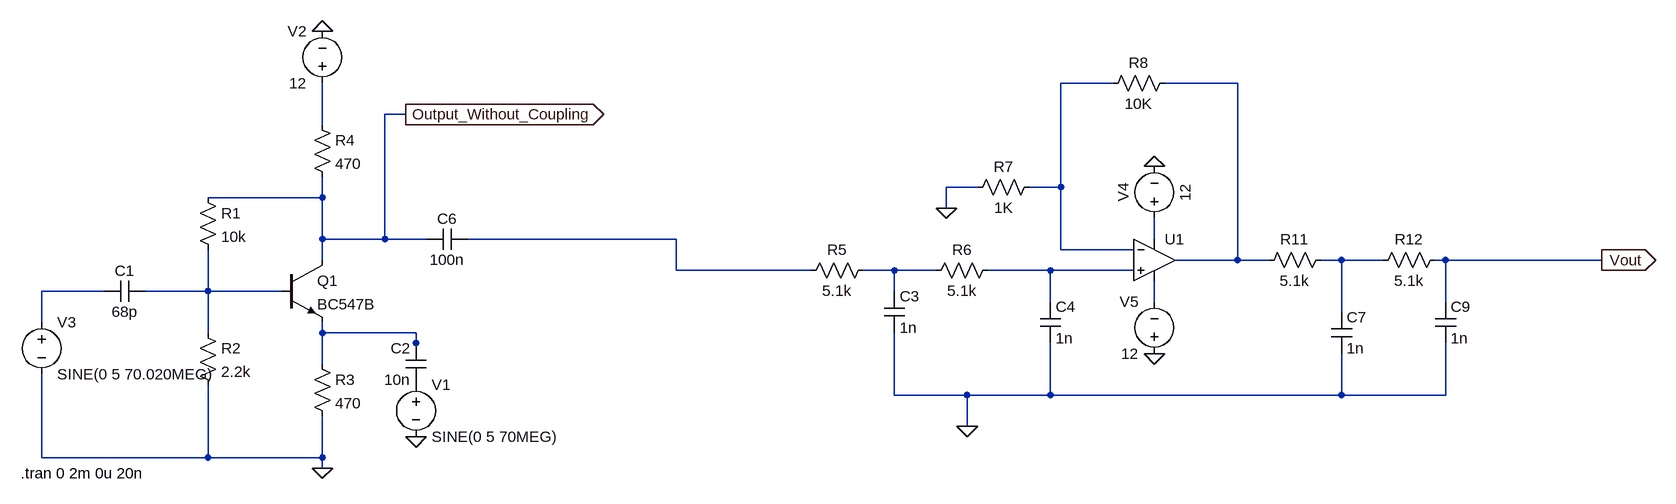
[diagram p0: schematic Mixer_Circuit_Cascade_LowPass.asc]
Mixer_Circuit_Cascade_LowPass.asc, the LTspice schematic file:
Version 4.1
SHEET 1 2324 680
WIRE 1424 -160 1344 -160
WIRE 1616 -160 1504 -160
WIRE 336 -112 304 -112
WIRE 208 -96 208 -160
WIRE 1216 0 1168 0
WIRE 1344 0 1344 -160
WIRE 1344 0 1296 0
WIRE 208 16 208 -16
WIRE 208 16 32 16
WIRE 1168 32 1168 0
WIRE 208 80 208 16
WIRE 304 80 304 -112
WIRE 304 80 208 80
WIRE 368 80 304 80
WIRE 752 80 432 80
WIRE 1488 80 1488 48
WIRE 1344 96 1344 0
WIRE 1456 96 1344 96
WIRE 208 112 208 80
WIRE 1616 112 1616 -160
WIRE 1616 112 1520 112
WIRE 1664 112 1616 112
WIRE 1776 112 1744 112
WIRE 1840 112 1776 112
WIRE 1936 112 1920 112
WIRE 2176 112 1936 112
WIRE 752 128 752 80
WIRE 960 128 752 128
WIRE 1088 128 1040 128
WIRE 1152 128 1088 128
WIRE 1328 128 1232 128
WIRE 1456 128 1328 128
WIRE -128 160 -224 160
WIRE 32 160 32 96
WIRE 32 160 -64 160
WIRE 144 160 32 160
WIRE 1088 160 1088 128
WIRE 1328 176 1328 128
WIRE 1488 176 1488 144
WIRE 1936 176 1936 112
WIRE 1776 192 1776 112
WIRE -224 208 -224 160
WIRE 32 224 32 160
WIRE 208 224 208 208
WIRE 352 224 208 224
WIRE 352 240 352 224
WIRE 352 256 352 240
WIRE 208 272 208 224
WIRE 1088 320 1088 224
WIRE 1200 320 1088 320
WIRE 1328 320 1328 240
WIRE 1328 320 1200 320
WIRE 1776 320 1776 256
WIRE 1776 320 1328 320
WIRE 1936 320 1936 240
WIRE 1936 320 1776 320
WIRE 1200 368 1200 320
WIRE -224 416 -224 288
WIRE 32 416 32 304
WIRE 32 416 -224 416
WIRE 208 416 208 352
WIRE 208 416 32 416
WIRE 208 432 208 416
FLAG 208 -240 0
FLAG 336 -112 Output_Without_Coupling
IOPIN 336 -112 Out
FLAG 208 432 0
FLAG 352 384 0
FLAG 2176 112 Vout
IOPIN 2176 112 Out
FLAG 1200 368 0
FLAG 1488 -32 0
FLAG 1488 256 0
FLAG 1168 32 0
SYMBOL npn 144 112 R0
SYMATTR InstName Q1
SYMATTR Value BC547B
SYMBOL res 16 0 R0
SYMATTR InstName R1
SYMATTR Value 10k
SYMBOL cap -64 144 R90
WINDOW 0 0 32 VBottom 2
WINDOW 3 32 32 VTop 2
SYMATTR InstName C1
SYMATTR Value 68p
SYMBOL cap 368 304 R180
WINDOW 0 24 56 Left 2
WINDOW 3 24 8 Left 2
SYMATTR InstName C2
SYMATTR Value 10n
SYMBOL res 192 256 R0
SYMATTR InstName R3
SYMATTR Value 470
SYMBOL res 192 -112 R0
SYMATTR InstName R4
SYMATTR Value 470
SYMBOL voltage 352 288 R0
WINDOW 123 0 0 Left 0
WINDOW 39 0 0 Left 0
SYMATTR InstName V1
SYMATTR Value SINE(0 5 70MEG)
SYMBOL voltage 208 -144 R180
WINDOW 0 24 96 Left 2
WINDOW 3 24 16 Left 2
WINDOW 123 0 0 Left 0
WINDOW 39 0 0 Left 0
SYMATTR InstName V2
SYMATTR Value 12
SYMBOL voltage -224 192 R0
WINDOW 123 0 0 Left 0
WINDOW 39 0 0 Left 0
SYMATTR InstName V3
SYMATTR Value SINE(0 5 70.020MEG)
SYMBOL res 16 208 R0
SYMATTR InstName R2
SYMATTR Value 2.2k
SYMBOL OpAmps\\UniversalOpAmp 1488 112 R0
SYMATTR InstName U1
SYMBOL res 1056 112 R90
WINDOW 0 0 56 VBottom 2
WINDOW 3 32 56 VTop 2
SYMATTR InstName R5
SYMATTR Value 5.1k
SYMBOL res 1248 112 R90
WINDOW 0 0 56 VBottom 2
WINDOW 3 32 56 VTop 2
SYMATTR InstName R6
SYMATTR Value 5.1k
SYMBOL cap 1072 160 R0
SYMATTR InstName C3
SYMATTR Value 1n
SYMBOL cap 1312 176 R0
SYMATTR InstName C4
SYMATTR Value 1n
SYMBOL res 1312 -16 R90
WINDOW 0 0 56 VBottom 2
WINDOW 3 32 56 VTop 2
SYMATTR InstName R7
SYMATTR Value 1K
SYMBOL res 1520 -176 R90
WINDOW 0 0 56 VBottom 2
WINDOW 3 32 56 VTop 2
SYMATTR InstName R8
SYMATTR Value 10K
SYMBOL cap 432 64 R90
WINDOW 0 0 32 VBottom 2
WINDOW 3 32 32 VTop 2
SYMATTR InstName C6
SYMATTR Value 100n
SYMBOL voltage 1488 64 R180
WINDOW 0 32 56 VTop 2
WINDOW 3 -32 56 VBottom 2
WINDOW 123 0 0 Left 0
WINDOW 39 0 0 Left 0
SYMATTR InstName V4
SYMATTR Value 12
SYMBOL res 1760 96 R90
WINDOW 0 0 56 VBottom 2
WINDOW 3 32 56 VTop 2
SYMATTR InstName R11
SYMATTR Value 5.1k
SYMBOL cap 1760 192 R0
SYMATTR InstName C7
SYMATTR Value 1n
SYMBOL res 1936 96 R90
WINDOW 0 0 56 VBottom 2
WINDOW 3 32 56 VTop 2
SYMATTR InstName R12
SYMATTR Value 5.1k
SYMBOL cap 1920 176 R0
SYMATTR InstName C9
SYMATTR Value 1n
SYMBOL voltage 1488 272 R180
WINDOW 0 24 96 Left 2
WINDOW 3 24 16 Left 2
WINDOW 123 0 0 Left 0
WINDOW 39 0 0 Left 0
SYMATTR InstName V5
SYMATTR Value 12
TEXT -256 440 Left 2 !.tran 0 2m 0u 20n

The netlist it stands for:
* Mixer_Circuit_Cascade_LowPass.asc
Q1 Output_Without_Coupling N010 N012 0 BC547B
R1 Output_Without_Coupling N010 10k
C1 N010 N009 68p
C2 P001 N012 10n
R3 N012 0 470
R4 N003 Output_Without_Coupling 470
V1 P001 0 SINE(0 5 70MEG)
V2 N003 0 12
V3 N009 0 SINE(0 5 70.020MEG)
R2 N010 0 2.2k
X§U1 N008 N001 N005 N011 N002 level1 Avol=1Meg GBW=10Meg Vos=0 En=0 Enk=0 In=0 Ink=0 Rin=500Meg  ; pins In+ In- V+ V- OUT
R5 N007 N004 5.1k
R6 N008 N007 5.1k
C3 N007 0 1n
C4 N008 0 1n
R7 N001 0 1K
R8 N002 N001 10K
C6 N004 Output_Without_Coupling 100n
V4 N005 0 12
R11 N006 N002 5.1k
C7 N006 0 1n
R12 Vout N006 5.1k
C9 Vout 0 1n
V5 0 N011 12
.model NPN NPN
.model PNP PNP
.lib standard.bjt
.tran 0 2m 0u 20n
.lib UniversalOpAmp1.lib
.backanno
.end